# Altium schematic sheet power.SchDoc
size A4; SheetNumber: 3; SheetTotal: 4
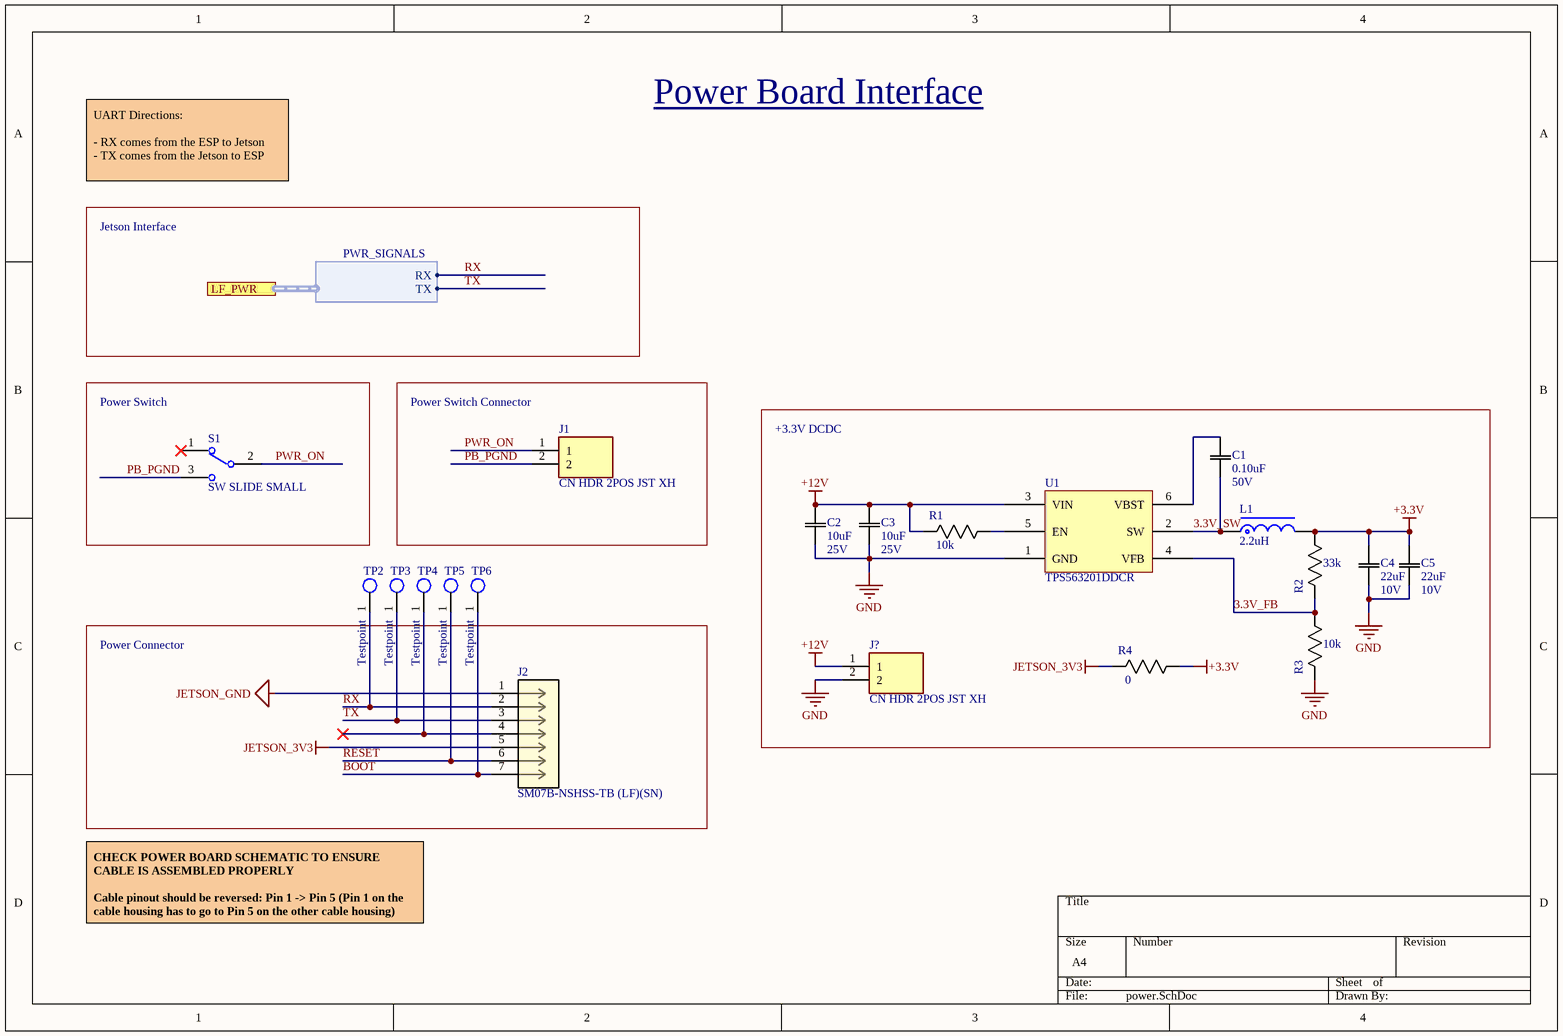
[diagram p0: power.SchDoc]

## Parts
C1  Rating: 50V  [0603]  (hidden comment: 0.10uF)
C2  Rating: 25V  [1206]  (hidden comment: 10uF)
C3  Rating: 25V  [1206]  (hidden comment: 10uF)
C4  Rating: 10V  [0805]  (hidden comment: 22uF)
C5  Rating: 10V  [0805]  (hidden comment: 22uF)
J1  CN HDR 2POS JST XH  [JST_B2B-XH-A(LF)(SN)]
J2  SM07B-NSHSS-TB (LF)(SN)  [JST_SM07B-NSHSS-TB_(LF)(SN)]
J?  CN HDR 2POS JST XH  [JST_B2B-XH-A(LF)(SN)]
L1  2.2uH  [L-SMD-0420]
R1  10k  [0603]
R2  33k  [0603]
R3  10k  [0603]
R4  0  [0603]
S1  SW SLIDE SMALL  [SW SLIDE SMALL]
TP2  Testpoint  [TP_1mm]
TP3  Testpoint  [TP_1mm]
TP4  Testpoint  [TP_1mm]
TP5  Testpoint  [TP_1mm]
TP6  Testpoint  [TP_1mm]
U1  TPS563201DDCR  [TSOT-23-6]

## Blocks framed on the sheet
Power Switch: S1
Power Switch Connector: J1
+3.3V DCDC: C1-C5 J? L1 R1-R4 U1
Power Connector: J2

## Ports
LF_PWR (harness PWR_SIGNALS)

## Harnesses
PWR_SIGNALS: TX, RX

## Nets
+3.3V: C4.2(C2) C5.2(C2) L1.2 R2.1(R1) R4.1(R1)
+12V: C2.2(C2) C3.2(C2) J?.1 R1.2(R2) U1.3(VIN)
GND: C2.1(C1) C3.1(C1) C4.1(C1) C5.1(C1) J?.2 R3.2(R2) U1.1(GND)
JETSON_3V3: J2.5 R4.2(R2)
JETSON_GND: J2.1
3.3V_FB: R2.2(R2) R3.1(R1) U1.4(VFB)
3.3V_SW: C1.1(C1) L1.1 U1.2(SW)
BOOT: J2.7 TP6.1(TP)
PB_PGND: J1.2 S1.3
PWR_ON: J1.1 S1.2
RESET: J2.6 TP5.1(TP)
RX: J2.2 TP2.1(TP) ; port LF_PWR.RX
TX: J2.3 TP3.1(TP) ; port LF_PWR.TX
NetC1_2: C1.2(C2) U1.6(VBST)
NetJ2_4: J2.4 TP4.1(TP)
NetR1_1: R1.1(R1) U1.5(EN)

Not connected (* = marked no-connect by the designer): S1 1*

## Notes on the sheet
- Power Board Interface
- UART Directions:
  - RX comes from the ESP to Jetson
  - TX comes from the Jetson to ESP
- Jetson Interface
- CHECK POWER BOARD SCHEMATIC TO ENSURE CABLE IS ASSEMBLED PROPERLY
  Cable pinout should be reversed: Pin 1 -> Pin 5 (Pin 1 on the cable housing has to go to Pin 5 on the other cable housing)

## Library data of the parts
C1 = CAP 0.1uF 50V: Default Symbol for Capacitors; Temperature Coefficient: X7R; Tolerance: 10%; Value: 0.10uF; Part Number: CAP 0.1uF 50V
C2 C3 = CAP 10uF 25V: Default Symbol for Capacitors; Temperature Coefficient: X5R; Tolerance: 10%; Value: 10uF; Part Number: CAP 10uF 25V
C4 C5 = CAP 22uF 10V: Default Symbol for Capacitors; Temperature Coefficient: X5R; Tolerance: 20%; Value: 22uF; Part Number: CAP 22uF 10V
J1 J? = CN HDR 2POS JST XH: Connector Header Through Hole 2 position 0.098 _2.50mm_ / JST XH; MP: B2B-XH-A_LF__SN_; MF: JST Sales; Price: None; Package: None; Value: *; SnapEDA_Link: https://www.snapeda.com/parts/B2B-XH-A%28LF%29%28SN%29/JST%20Sales%20America%20Inc./view-part/492310/?ref=snap; Part Number: CN HDR 2POS JST XH; Pin Count: 2
J2 = CN 7POS JST NSH SMT RA: Connector Header Surface Mount, Right Angle 7 position 0.039" (1.00mm); MP: SM12B-NSHSS-TB (LF)(SN); MF: JST Sales America Inc.; Package: None; Check_prices: https://www.snapeda.com/parts/SM12B-NSHSS-TB%20(LF)(SN)/JST%20Sales%20America%20Inc./view-part/5255521/?ref=eda; Value: *; Availability: Unavailable; Price: None; SnapEDA_Link: https://www.snapeda.com/parts/SM12B-NSHSS-TB%20(LF)(SN)/JST%20Sales%20America%20Inc./view-part/5255521/?ref=snap; Supplier 1: Digi-Key; Supplier 2: Digi-Key; Supplier 3: Digi-Key; Supplier 4: Digi-Key; Supplier Part Number 1: 455-2771-1-ND; Supplier Part Number 2: 455-2771-1-ND; Supplier Part Number 3: 455-2771-6-ND; Supplier Part Number 4: 455-2771-2-ND; Part Number: CN 7POS JST NSH SMT RA; Supplier URL 1: https://www.digikey.ca/en/products/detail/jst-sales-america-inc/SM07B-NSHSS-TB-LF-SN/3313637; Pin Count: 7
L1 = IND 2.2uH 3A 0420: Standard inductor symbol; Part Number: IND 2.2uH 3A 0420; Value: 2.2uH
R1 R3 = RES 10k 1/8W - 1%: Default Resistor Symbol; Manufacturer Part Number 1: ERJ-H3GJ103V; Power (Watts): 0.125W; Tolerance: 5%; Package: 0805; Value: 10k; Part Number: RES 10k 1/8W - 1%; Supplier 1: Digi-Key; Supplier Part Number 1: 10-ERJ-H3GJ103VCT-ND; Supplier URL 1: https://www.digikey.ca/en/products/detail/panasonic-electronic-components/ERJ-H3GJ103V/13877876?s=N4IgTCBcDaIIwAYC0BRASgKSQCQMwHENFcA1AYQBUkA5AERAF0BfIA; Manufacturer Part Number 2: RMCF0805JT10K0; Supplier 2: Digi-Key; Supplier Part Number 2: RMCF0805JT10K0CT-ND; Supplier URL 2: https://www.digikey.ca/en/products/detail/stackpole-electronics-inc/RMCF0805JT10K0/1757762?s=N4IgTCBcDaIEoFkDCAxADADjQVgFIBUBGNAaTSXxAF0BfIA; Tolerance 2: 5%
R2 = RES 33k 1/8W: Default Resistor Symbol; Power (Watts): 0.125W; Tolerance: 5%; Package: 0805; Value: 33k; Part Number: RES 33k 1/8W
R4 = RES 0 JUMPER 0603: Default Resistor Symbol; Power (Watts): 0.125W; Package: 0805; Tolerance: N/A; Value: 0; Part Number: RES 0 JUMPER 0603
S1 = SW SLIDE SMALL: Slide Switch SPDT Surface Mount, Right Angle; Manufacturer Part Number 1: JS102011SAQN SPDT; MF: C&K; MP: JS102011SAQN; Availability: Unavailable; Price: None; SnapEDA_Link: https://www.snapeda.com/parts/JS102011SAQN/C%26K/view-part/214325/?ref=snap; Value: *; Package: None; Part Number: SW SLIDE SMALL; Supplier 1: Digi-key; Supplier Part Number 1: JS102011SAQN SPDT; Supplier URL 1: https://www.digikey.ca/en/products/detail/c-k/JS102011SAQN/1640095
TP2-TP6 = TP_1MM: Part Number: TP_1MM
U1 = TPS563201DDCR: 17 V Input, 3A Synchronous Step-Down Regulator in SOT-23 with Advanced Eco-mode™; Part Number: TPS563201DDCR